# EasyEDA Pro project CoreBoard-001_2024-04-29.epro, board PCB-CoreBoard-001
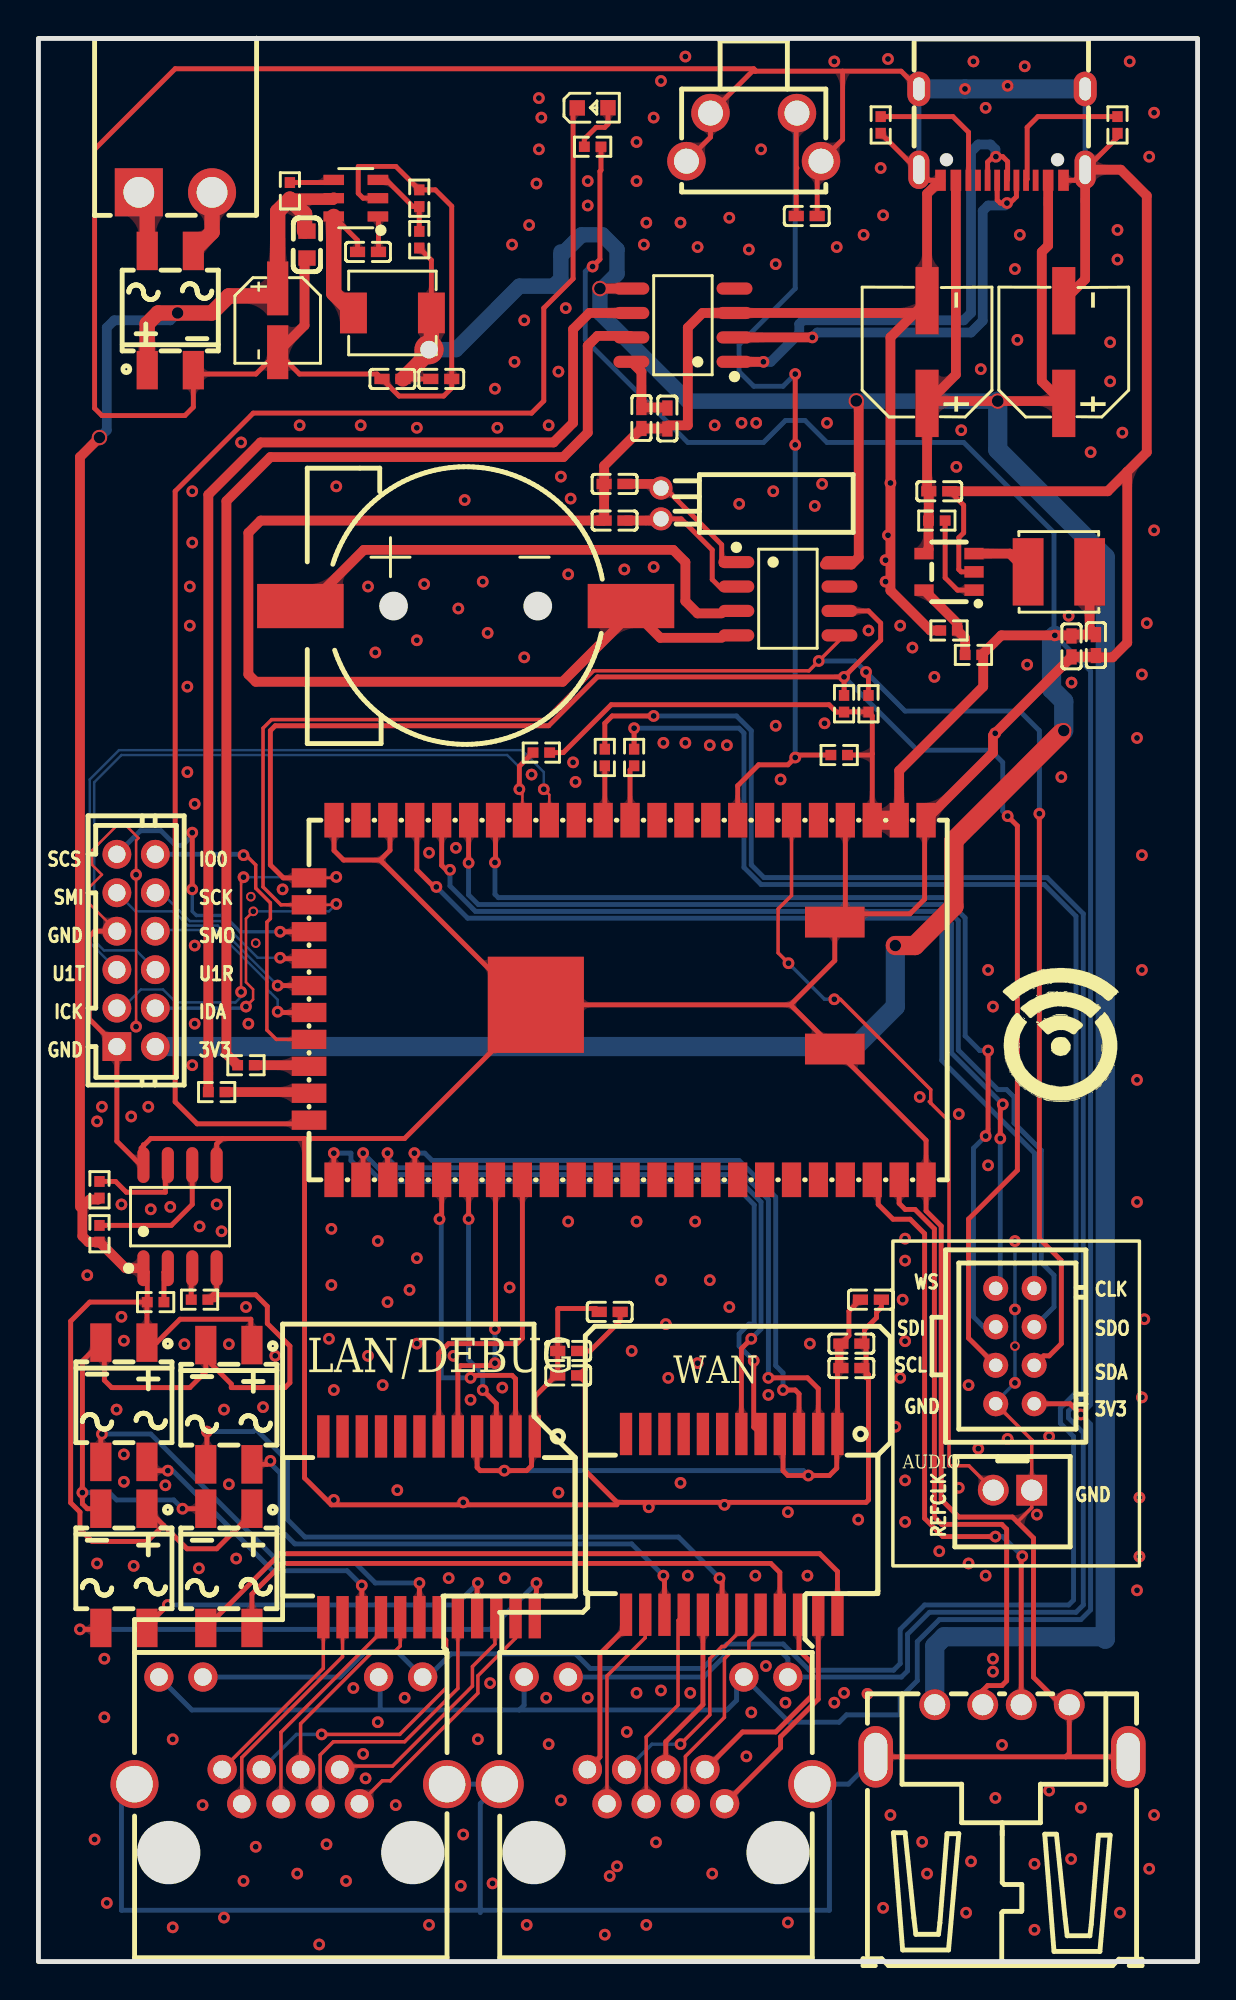
[diagram p6: board, top side]
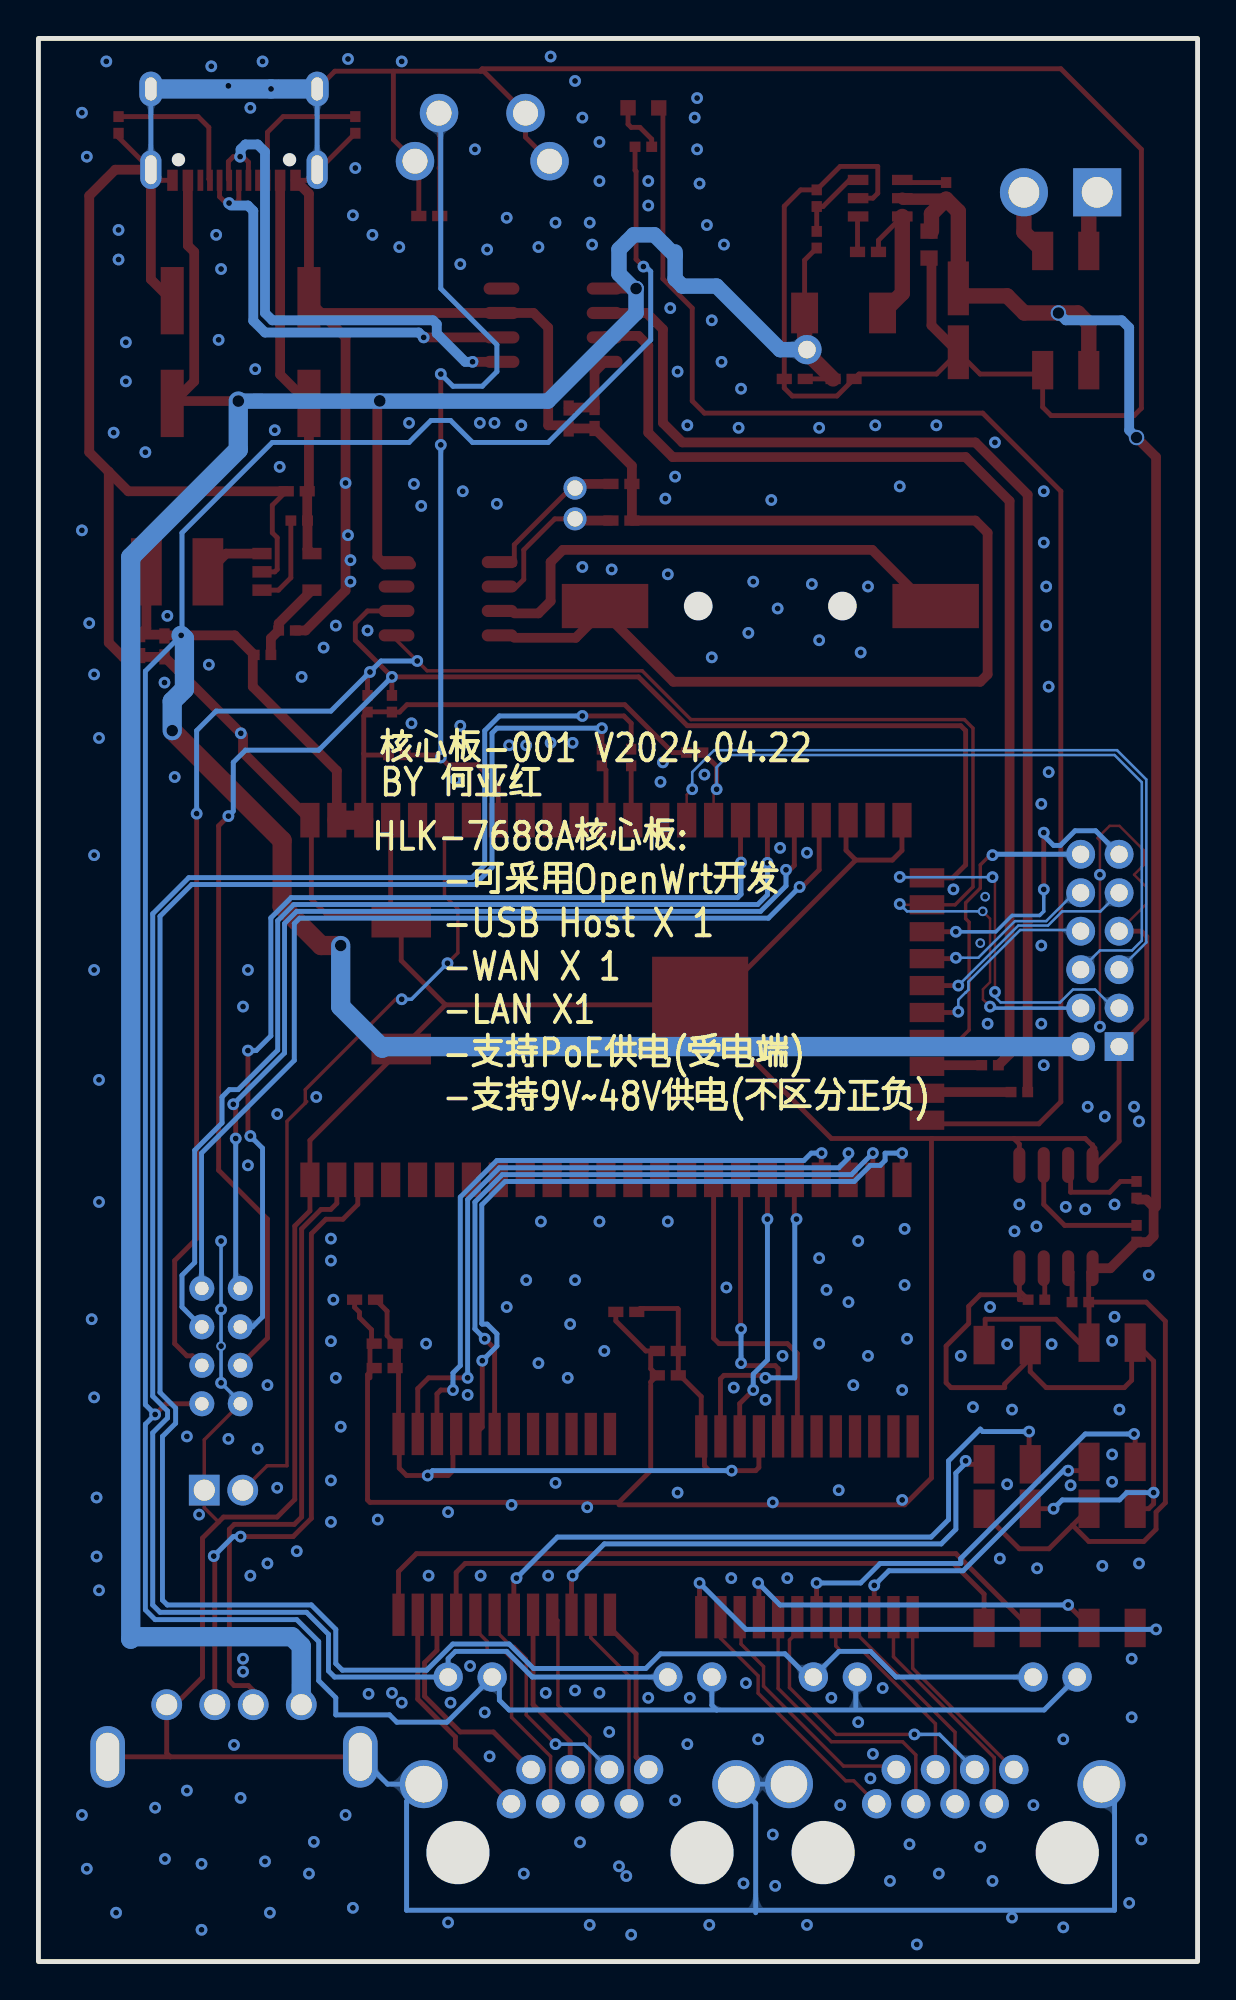
[diagram p7: board, bottom side, seen from below]

Outline 60.3 x 100 mm; copper layers: Top Layer, Bottom Layer. Coordinates in mm from the lower left corner of the outline.
Outline path: rectangle 0,100 60.3,0
Stack: Top Layer 0.035mm / Dielectric1 1.51mm FR4 er 4.5 / Bottom Layer 0.035mm

## Design rules (mm)
net USB_DP: USB
net USB_DM: USB
template: JLCPCB Capability(Two Layers Board)
spacing copperThickness1oz (default): track to track 0.102, other pairs 0.152 to 0.3
spacing copperThickness2oz: track to track 0.203, other pairs 0.152 to 0.3
track width copperThickness1oz (default): min 0.127, default 0.254, max 2.54
track width copperThickness2oz: min 0.203, default 0.254, max 2.54
differential pair differentialPair (default): width min 0.127, default 0.254, max 2.54; gap min 0.152, default 0.152
via viaSize (default): diameter min 0.5, default 0.61, max 10; hole min 0.3, default 0.305, max 6.3

## Placement (name value [footprint] x y rotation side)
BT1  CR1220-2ZX  [BAT-SMD_CR1220-2ZX]  22.23 70.48 0 top
C1  12pF  [C0402]  29.97 74.93 180 top
C2  12pF  [C0402]  29.97 76.83 180 top
C9  10uF  [C0402]  43.31 34.42 180 top
C15  10uF  [C0402]  46.86 76.45 180 top
C16  10uF  [C0402]  55.01 68.45 90 top
C17  100nF  [C0402]  53.74 68.39 90 top
C18  4.7uF  [CAP-SMD_BD4.0-L4.3-W4.3-FD-A]  12.45 85.34 270 top
C19  100nF  [C0603]  13.97 89.28 90 top
C20  10uF  [C0402]  18.42 82.3 180 top
C21  10uF  [C0402]  20.95 82.3 0 top
C22  100uF  [CAP-SMD_BD6.3-L6.6-W6.6-FD]  53.34 83.69 90 top
C23  100uF  [CAP-SMD_BD6.3-L6.6-W6.6-FD]  46.23 83.69 90 top
C24  100nF  [C0402]  31.37 80.26 90 top
C25  10uF  [C0402]  32.72 80.24 270 top
C26  100nF  [C0402]  39.97 90.77 180 top
C27  100nF  [C0402]  17.14 88.9 0 top
C28  10uF  [C0402]  42.29 30.86 180 top
C29  10uF  [C0402]  42.29 32.13 180 top
C30  10uF  [C0402]  27.56 30.48 180 top
C31  10uF  [C0402]  27.56 31.75 180 top
C32  10uF  [C0402]  29.72 33.78 180 top
CN1  DB2ERC-3.81-2P-GN  [CONN-TH_2P-P3.81_DB2ERC-3.81-2P]  7.13 92 180 top
CN2  扩展接口  [CONN-TH_12P-P2.00_HCTL_HC-PHD]  5.08 52.58 270 top
CN3  PH-2A  [CONN-TH_PH-2A_C2908623]  50.67 24.51 180 top
D1  MB10S  [MBS_L4.7-W3.8-P2.40-LS7.0-TL]  6.86 85.85 90 top
D2  MB10S  [MBS_L4.7-W3.8-P2.40-LS7.0-TL]  9.91 20.45 270 top
D3  MB10S  [MBS_L4.7-W3.8-P2.40-LS7.0-TL]  9.91 28.96 270 top
D4  MB10S  [MBS_L4.7-W3.8-P2.40-LS7.0-TL]  4.44 20.45 270 top
D5  MB10S  [MBS_L4.7-W3.8-P2.40-LS7.0-TL]  4.44 29.08 270 top
L1  4.7uH  [IND-SMD_L4.0-W4.0]  53.09 72.26 0 top
L2  10uH  [IND-SMD_L4.4-W4.2]  18.42 85.72 180 top
LED1  NCD0603R1  [LED0603-RD_RED]  28.83 96.39 0 top
NOREF  -  [Pad_e347]  20.32 83.82 0 top
R1  5.1kΩ  [R0402]  43.81 95.5 270 top
R2  5.1kΩ  [R0402]  56.13 95.5 270 top
R3  100Ω  [R0402]  9.27 45.21 180 top
R4  100Ω  [R0402]  10.8 46.61 180 top
R5  10kΩ  [R0402]  41.91 65.41 90 top
R6  10kΩ  [R0402]  43.18 65.41 90 top
R7  24.9kΩ  [R0402]  6.1 34.29 0 top
R8  33kΩ  [R0402]  3.17 40.13 270 top
R9  200kΩ  [R0402]  3.17 37.85 270 top
R11  1kΩ  [R0402]  46.74 74.93 180 top
R12  68kΩ  [R0402]  48.64 67.94 180 top
R13  15kΩ  [R0402]  47.37 69.22 180 top
R14  1kΩ  [R0402]  41.66 62.74 180 top
R15  1kΩ  [R0402]  28.83 94.37 0 top
R18  100kΩ  [R0402]  13.08 92.08 270 top
R19  10.7kΩ  [R0402]  19.81 91.69 270 top
R20  56kΩ  [R0402]  19.81 89.53 270 top
R21  1kΩ  [R0402]  29.46 62.61 270 top
R22  1kΩ  [R0402]  30.99 62.61 270 top
R23  10kΩ  [R0402]  26.16 62.86 180 top
RJ1  R-RJ45R08P-C000  [RJ45-TH_R-RJ45R08P-C000]  32.13 11.5 0 top
RJ2  R-RJ45R08P-C000  [RJ45-TH_R-RJ45R08P-C000]  13.13 11.5 0 top
SW1  TS665ZJ  [SW-TH_TS665ZJ]  37.21 94.87 180 top
U1  2.412GHz；2.483GHz  [WIRELM-SMD_HLK-7688A]  30.13 50 0 top
U2  DS1307M/TR  [SOP-8_L4.9-W3.9-P1.27-LS6.0-BL]  38.99 70.87 270 top
U3  SY8089AAAC  [SOT-23-5_L3.0-W1.7-P0.95-LS2.8-BR]  47.37 72.26 0 top
U4  CH340N  [SOP-8_L4.9-W3.9-P1.27-LS6.0-BL]  33.53 85.09 90 top
U5  LGS5148  [SOT-23-6_L2.9-W1.6-P0.95-LS2.8-BL]  16.51 91.69 90 top
U6  G2415S  [SMD-24_L15.1-W7.1-P1.00-LS10.0-BL]  36.07 22.73 180 top
U7  XS2100S  [SOP-8_L4.9-W3.9-P1.27-LS6.0-BL]  7.37 38.73 0 top
U8  G2415S  [SMD-24_L15.1-W7.1-P1.00-LS10.0-BL]  20.32 22.61 180 top
U9  1.27kΩ  [R0402]  8.38 34.42 180 top
U12  HC-PHB2.0-2x4A  [CONN-TH_8P-P2.00_HC-PHB2.0-2X4A]  50.8 32 270 top
USB1  TYPE-C 16PIN 2MD(073)  [USB-C-SMD_TYPE-C-6PIN-2MD-073]  50.13 95 180 top
USB2  U-USBAR04P-F002  [USB-A-TH_USB-302-T]  50.13 12 0 top
X1  32.768kHz  [OSC-TH_BD3.1-P0.8-D0.3]  32.39 75.82 180 top

## Footprints (pads in the part's own frame, mm; a bottom-side part is the same pattern mirrored in y, then rotated)
BAT-SMD_CR1220-2ZX
  rect 4.5x2.3 smd: 1(-8.6,0) 2(8.6,0)
C0402
  rect 0.79x0.54 smd: 1(-0.545,0) 2(0.545,0)
C0603
  rect 0.8x0.9 smd: 1(-0.7,0) 2(0.7,0)
CAP-SMD_BD4.0-L4.3-W4.3-FD-A
  rect 2.8x1.1 smd: 1(-1.661,0) 2(1.661,0)
CAP-SMD_BD6.3-L6.6-W6.6-FD
  rect 3.5x1.2 smd: 1(-2.67,0) 2(2.67,0)
CONN-TH_2P-P3.81_DB2ERC-3.81-2P
  rect 2.5x2.5 hole 1.6: 1(1.905,0)
  round 2.5 hole 1.6: 2(-1.905,0)
CONN-TH_8P-P2.00_HC-PHB2.0-2X4A
  round 1.3 hole 0.7: 1(3,-1) 2(3,1) 3(1,-1) 4(1,1) 5(-1,-1) 6(-1,1) 7(-3,-1) 8(-3,1)
CONN-TH_12P-P2.00_HCTL_HC-PHD
  rect 1.5x1.5 hole 0.9: 1(5,-1)
  round 1.5 hole 0.9: 2(5,1) 3(3,-1) 4(3,1) 5(1,-1) 6(1,1) 7(-1,-1) 8(-1,1) 9(-3,-1) 10(-3,1) 11(-5,-1) 12(-5,1)
CONN-TH_PH-2A_C2908623
  rect 1.6x1.6 hole 1.1: 1(-1,0)
  round 1.6 hole 1.1: 2(1,0)
IND-SMD_L4.0-W4.0
  rect 1.6x3.5 smd: 1(-1.6,0) 2(1.6,0)
IND-SMD_L4.4-W4.2
  rect 1.4x2.12 smd: 1(2.028,0) 2(-2.028,0)
LED0603-RD_RED
  rect 0.8x0.8 smd: 1(-0.799,-0.004) 2(0.799,0.004)
MBS_L4.7-W3.8-P2.40-LS7.0-TL
  rect 2x1.1 smd: 1(-3.1,1.2) 2(-3.1,-1.2) 3(3.1,-1.2) 4(3.1,1.2)
OSC-TH_BD3.1-P0.8-D0.3
  round 1.2 hole 0.8: 1(0,0.8) 2(0,-0.8)
Pad_e347
  round 1.524 hole 0.914: 60(0,0)
R0402
  rect 0.566x0.54 smd: 1(-0.433,0) 2(0.433,0)
RJ45-TH_R-RJ45R08P-C000
  round 1.524 hole 0.914: 1(3.57,-3.295) 2(2.55,-1.515) 3(1.53,-3.295) 4(0.51,-1.515) 5(-0.51,-3.295) 6(-1.53,-1.515) 7(-2.55,-3.295) 8(-3.57,-1.515) 9(-6.86,3.295) 10(-4.57,3.295) 11(4.57,3.295) 12(6.86,3.295)
  round 2.5 hole 1.9: 13(8.13,-2.275) 14(-8.13,-2.275)
SMD-24_L15.1-W7.1-P1.00-LS10.0-BL
  rect 0.64x2.2 smd: 1(-5.5,-4.7) 2(-4.5,-4.7) 3(-3.5,-4.7) 4(-2.5,-4.7) 5(-1.5,-4.7) 6(-0.5,-4.7) 7(0.5,-4.7) 8(1.5,-4.7) 9(2.5,-4.7) 10(3.5,-4.7) 11(4.5,-4.7) 12(5.5,-4.7) 13(5.5,4.7) 14(4.5,4.7) 15(3.5,4.7) 16(2.5,4.7) 17(1.5,4.7) 18(0.5,4.7) 19(-0.5,4.7) 20(-1.5,4.7) 21(-2.5,4.7) 22(-3.5,4.7) 23(-4.5,4.7) 24(-5.5,4.7)
SOP-8_L4.9-W3.9-P1.27-LS6.0-BL
  oval 0.63x1.865 smd: 1(-1.905,-2.683) 2(-0.635,-2.683) 3(0.635,-2.683) 4(1.905,-2.683) 5(1.905,2.683) 6(0.635,2.683) 7(-0.635,2.683) 8(-1.905,2.683)
SOT-23-5_L3.0-W1.7-P0.95-LS2.8-BR
  rect 1x0.6 smd: 1(1.3,-0.95) 2(1.3,0) 3(1.3,0.95) 4(-1.3,0.95) 5(-1.3,-0.95)
SOT-23-6_L2.9-W1.6-P0.95-LS2.8-BL
  rect 0.532x1.072 smd: 1(-0.95,-1.149) 2(0,-1.149) 3(0.95,-1.149) 4(0.95,1.149) 5(0,1.149) 6(-0.95,1.149)
SW-TH_TS665ZJ
  round 2 hole 1.3: 1(-2.25,-1.25) 2(2.25,-1.25) 3(-3.5,1.25) 4(3.5,1.25)
USB-A-TH_USB-302-T
  round 1.6 hole 1.1: 1(-3.5,1.355) 2(-1,1.355) 3(1,1.355) 4(3.5,1.355)
  oval 1.8x3.2 hole 1.2x2.5: 5(-6.57,-1.355) 6(6.57,-1.355)
USB-C-SMD_TYPE-C-6PIN-2MD-073
  rect 0.55x1.1 smd: 1(-3.2,2.375) 2(-2.4,2.375) 11(2.4,2.375) 12(3.2,2.375)
  rect 0.3x1.1 smd: 3(-1.75,2.375) 4(-1.25,2.375) 5(-0.75,2.375) 6(-0.25,2.375) 7(0.25,2.375) 8(0.75,2.375) 9(1.25,2.375) 10(1.75,2.375)
  oval 1.1x2 hole 0.6x1.5: 13(-4.325,1.825) 14(4.325,1.825)
  oval 1.2x1.8 hole 0.6x1.2: 13(-4.325,-2.375) 14(4.325,-2.375)
WIRELM-SMD_HLK-7688A
  rect 1x1.8 smd: 1(16.05,9.35) 2(14.65,9.35) 3(13.25,9.35) 4(11.85,9.35) 5(10.45,9.35) 6(9.05,9.35) 7(7.65,9.35) 8(6.25,9.35) 9(4.85,9.35) 10(3.45,9.35) 11(2.05,9.35) 12(0.65,9.35) 13(-0.75,9.35) 14(-2.15,9.35) 15(-3.55,9.35) 16(-4.95,9.35) 17(-6.35,9.35) 18(-7.75,9.35) 19(-9.15,9.35) 20(-10.55,9.35) 21(-11.95,9.35) 22(-13.35,9.35) 23(-14.75,9.35) 34(-14.75,-9.35) 35(-13.35,-9.35) 36(-11.95,-9.35) 37(-10.55,-9.35) 38(-9.15,-9.35) 39(-7.75,-9.35) 40(-6.35,-9.35) 41(-4.95,-9.35) 42(-3.55,-9.35) 43(-2.15,-9.35) 44(-0.75,-9.35) 45(0.65,-9.35) 46(2.05,-9.35) 47(3.45,-9.35) 48(4.85,-9.35) 49(6.25,-9.35) 50(7.65,-9.35) 51(9.05,-9.35) 52(10.45,-9.35) 53(11.85,-9.35) 54(13.25,-9.35) 55(14.65,-9.35) 56(16.05,-9.35)
  rect 1.8x1 smd: 24(-16.05,6.35) 25(-16.05,4.95) 26(-16.05,3.55) 27(-16.05,2.15) 28(-16.05,0.75) 29(-16.05,-0.65) 30(-16.05,-2.05) 31(-16.05,-3.45) 32(-16.05,-4.85) 33(-16.05,-6.25)
  rect 5x5 smd: 57(-4.25,-0.25)
  rect 3.1x1.6 smd: 58(11.3,-2.55) 59(11.3,4.05)

## Nets
As in the schematic, except:
5V: C15.2 C20.1 C21.1 C22.1 C23.1 L2.2 NOREF.60 R11.2 R20.2 U2.8 U3.4 U4.5 USB1.2 USB1.11 USB2.1

Pads without a net: U1 5 7 14 22; U2 7; U4 4; U6 7 8 9 10 11 12; U8 7 8 9 10 11 12; USB1 3 9

## Via types
v1: diameter 0.61, hole 0.305, Top Layer to Bottom Layer, 369 vias
v2: diameter 0.5, hole 0.305, Top Layer to Bottom Layer, 4 vias
v3: diameter 0.8, hole 0.6, Top Layer to Bottom Layer, 4 vias
v4: diameter 0.8, hole 0.61, Top Layer to Bottom Layer, 3 vias

## Routing (per net, layer and track width the routed paths; a pad name or vN(x,y) marks a point on that pad's centre or on a via; arc(x,y) is an arc through that point)
3V3: length 268.1
  Top Layer w0.254: 43.38,62.81 43.38,64.78 R6.1 43.17,64.99 41.91,64.99 ; 43.38,62.81 U1.3 ; 43.38,62.81 43.31,62.74 R14.1 ; v1(28.83,88.14) 29.21,88.52 29.21,93.09 29.26,93.14 R15.2 ; U12.2 53.67,29 v1(54.23,28.45) ; R5.1 41.51,64.97 41.13,65.35 29.79,65.35 27.3,62.86 R23.1
  Top Layer w0.508: 53.59,68.96 v1(52.88,68.96) 50.09,68.96 R12.1 49.15,67.87 49.15,66.29 44.78,61.92 U1.2 ; L1.2 54.69,69.33 C16.2 53.81,69 C17.2
  Top Layer w1: 53.21,63.88 47.62,58.29 47.62,54.86 45.59,52.83 v3(44.58,52.83) ; U1.3 U1.2
  Bottom Layer w0.254: RJ2.9 7.98,13.08 25.02,13.08 ; v1(52.88,68.96) 54.74,67.1 54.74,28.96 v1(54.23,28.45) 54.74,27.94 54.74,18.29 54.23,17.78 46.86,17.78 45.72,16.64 45.72,14.6 44.83,13.72 44.83,12.83 42.04,12.83 41.66,12.45 39.05,12.45 RJ1.11 36.32,14.42 36.32,13.59 35.81,13.08 25.02,13.08 ; RJ1.9 25.27,13.33 25.02,13.08 ; 17.78,13.21 17.78,14.71 RJ2.11 ; 52.83,68.96 52.83,74.3 48.13,78.99 41.02,78.99 39.88,80.14 38.86,80.14 37.72,78.99 33.78,78.99 28.45,84.33 28.45,87.88 28.7,88.14 v1(28.83,88.14)
  Bottom Layer w1: v3(44.58,52.83) 44.58,49.66 42.42,47.5 42.34,47.58 CN2.2 ; v1(52.88,68.96) 52.7,68.79 52.7,66.17 53.34,65.53 v3(53.34,64.01)
5V: length 178.8
  Top Layer w0.254: C21.1 C20.1 ; R20.2 20.44,88.47 L2.2
  Top Layer w0.508: 40.91,72.64 42.29,72.64 42.67,73.03 42.67,81.03 v4(42.55,81.15) ; 53.22,81.14 52.2,82.17 52.2,88.9 52.53,89.23 USB1.2 ; 53.22,81.14 v4(49.9,81.14) 46.35,81.14 ; 53.22,81.14 C22.1 ; v4(29.21,87) U4.5 ; USB1.11 47.73,82.52 46.35,81.14 ; 46.07,73.21 46.3,73.44 R11.2 46.32,74.94 C15.2 46.23,76.54 C23.1 46.35,81.14
  Top Layer w0.8: C20.1 20.44,83.78 L2.2
  Bottom Layer w0.8: v4(49.9,81.14) 33.79,81.14 29.21,85.72 v4(29.21,87) 29.34,87 30.1,87.76 30.1,89.03 29.34,89.79 28.26,89.79 27.18,88.71 ; 27.18,88.71 27.18,88.9 ; 27.18,88.71 27.18,87.5 26.8,87.12 25.02,87.12 21.72,83.82 NOREF.60
  Bottom Layer w1: v4(49.9,81.14) 49.9,78.62 55.5,73.03 55.5,16.76 55.37,16.89 47.12,16.89 46.63,16.4 USB2.1
GND: length 633.6
  Top Layer w0.13: v1(5.08,48.61) v1(5.08,56.52) 5.08,58.29 5.21,58.42 4.57,59.06 4.06,59.06 2.79,57.78 2.79,57.02 3.3,56.52 2.67,55.88 2.67,54.99 CN2.7
  Top Layer w0.18: U12.1 51.67,27.13 CN3.1 51.67,23.6 50.93,22.86
  Top Layer w0.254: R2.2 56.13,94.86 USB1.13 53.9,92.62 USB1.1 ; 17.78,57.28 18.29,57.78 18.29,59.24 U1.21 ; 17.78,57.28 25.31,49.75 U1.57 ; 17.78,57.28 15.87,57.28 15.38,57.78 U1.23 ; C15.1 48.13,75.73 48.13,74.3 47.88,74.04 47.88,72.39 48.01,72.26 U3.2 ; U1.1 46.1,59.27 46.1,55.25 45.34,54.48 42.04,54.48 ; 28.45,30.1 28.45,30.14 C30.1 28.45,30.82 28.45,31.75 ; 42.97,31.99 43.05,31.91 43.05,30.64 ; 42.97,31.99 42.97,32.85 43.6,33.48 43.6,33.77 43.85,34.02 C9.1 ; 42.97,31.99 C29.1 ; 53.44,10.65 USB2.6 ; 53.44,10.65 53.63,10.83 USB2.4 53.19,13.35 51.77,14.78 51.77,22.02 50.67,23.11 47.88,23.11 46.96,24.03 46.96,38.25 46.18,39.03 U1.56 46.18,42.7 U1.58 39.13,49.75 ; 53.44,10.65 USB2.5 ; 30.1,23.75 15.24,23.75 13.84,25.15 13.84,42.78 13.82,42.8 ; 5.46,42.42 5.46,42.48 ; 5.46,42.42 5.33,42.29 ; 5.46,42.42 5.84,42.8 9.56,42.8 ; 5.46,42.42 U7.8 5.39,41.35 4.08,42.66 CN2.1 2.64,49.02 2.64,53.3 2.92,53.58 CN2.7 ; U1.57 25.88,49.63 19.05,42.8 13.82,42.8 ; U1.57 39.13,49.75 ; C31.1 28.45,31.75 ; 28.45,31.75 28.7,31.75 30.26,33.31 C32.1 ; 39.13,49.75 41.43,52.05 U1.59 41.98,54.6 U1.4 ; 9.56,42.8 9.27,42.51 U7.5 ; 9.56,42.8 13.82,42.8 ; 43.05,30.64 43.18,30.52 43.18,24 43.05,23.88 30.1,23.88 28.45,25.53 28.45,29.97 ; 43.05,30.64 C28.1 ; 43.05,30.64 43.05,30.35 ; 37.3,98.3 37.3,98.34 37.21,98.42 7.11,98.42 2.92,94.23 2.92,80.77 3.3,80.39 7.62,80.39 8.06,80.83 8.06,82.55 ; 37.3,98.3 41.83,98.3 ; 37.3,98.3 37.14,98.3 SW1.2 34.96,94.87 SW1.4 ; 41.83,98.3 44.88,98.3 USB1.14 ; 41.83,98.3 41.83,94.74 SW1.3 40.51,93.42 C26.1 ; U5.2 16.89,91.69 16.64,91.95 16.64,93.34 18.59,93.34 R19.1 20.65,92.13 21.5,91.28 C21.2 21.5,81.83 21.08,81.41 18.76,81.41 C20.2 17.62,82.55 13.58,82.55 C18.2 11.31,82.55 8.06,82.55 ; 8.06,82.55 D1.2 ; USB1.12 46.35,92.62 USB1.14 45.71,93.17 R1.2
  Top Layer w0.508: 55.12,67.82 55.88,67.82 56.64,68.58 56.64,77.47 ; 35.54,68.83 32.35,68.83 30.95,70.23 27.27,66.55 11.3,66.55 10.92,66.93 10.92,74.3 11.56,74.93 C1.2 C2.2 29.43,77.78 C24.1 32.69,79.72 C25.2 ; 45.59,85.72 34.54,85.72 33.78,84.96 33.78,79.88 32.77,79.88 ; 45.59,85.72 C23.2 46.23,91.93 USB1.12 ; 45.59,85.72 44.32,84.46 v1(44.32,76.88) 44.32,71.29 46.4,69.22 R13.2 ; 56.64,77.47 57.66,78.49 57.66,91.82 56.3,93.17 USB1.13 54.45,87.47 C22.2 ; 56.64,77.47 55.63,76.45 C15.1 ; 13.84,88.58 13.84,85.08 C18.2 ; U1.1 46.18,59.39 49.66,62.86 49.66,63.76 C17.1 54.94,67.84 C16.1
  Bottom Layer w0.18: v1(50.8,37.47) v1(50.8,33.91) v2(50.8,32) v1(50.8,30.09) 49.8,29.09 U12.1
  Bottom Layer w0.254: 22.99,2.54 22.99,2.67 ; 22.99,2.67 41.15,2.67 41.15,8.33 RJ1.13 42.14,9.22 USB2.5 ; 22.99,2.67 4.32,2.67 4.32,8.55 RJ2.14 ; 22.99,2.67 22.99,8.22 RJ1.14 RJ2.13 ; USB1.13 USB1.13 ; USB1.14 USB1.14
  Bottom Layer w1: USB1.14 v1(48.2,97.38) USB1.13
  vias: v1(2.54,35.69) v1(2.92,6.35) v1(3.05,43.69) v1(3.05,20.7) v1(3.3,44.45) v1(3.43,15.75) v1(3.43,12.7) v1(3.56,3.05) v1(4.06,28.7) v1(4.32,39.37) v1(4.32,33.53) v1(4.44,32.28) v1(4.44,26.37) v1(4.44,24.95) v1(4.83,43.94) v1(4.95,20.57) v1(5.71,44.45) v1(5.84,39.12) v1(6.6,24.76) v1(6.86,39.24) v1(6.98,11.56) v1(6.98,1.78) v1(7.59,32.1) v1(7.75,66.29) v1(7.75,61.85) v1(7.87,71.5) v1(7.87,69.47) v1(8,76.45) v1(8,73.79) v1(8,46.61) v1(8.13,60.2) v1(8.13,52.83) v1(8.13,48.77) v1(8.35,20.45) v1(8.38,38.23) v1(8.54,8.13) v1(9.27,39.37) v1(9.52,37.97) v1(9.65,28.7) v1(9.65,2.29) v1(9.91,32.1) v1(9.91,24.82) v1(10.29,20.96) v1(10.54,78.99) v1(10.67,4.19) v1(10.8,34.04) v1(10.92,48.77) v1(11.3,5.97) v1(11.68,28.83) v1(12.32,31.5) v1(12.7,55.75) v1(13.46,4.57) v1(13.59,79.88) v1(14.61,0.89) v1(14.99,6.1) v1(15.11,32.39) v1(15.24,38.1) v1(15.24,35.18) v1(15.37,29.72) v1(15.37,24) v1(15.49,76.71) v1(16,4.19) v1(16.38,14.22) v1(16.76,79.88) v1(16.89,10.79) v1(17.02,9.53) v1(17.14,71.5) v1(17.14,31.5) v1(17.53,68.07) v1(17.65,37.47) v1(17.65,12.45) v1(17.91,29.97) v1(18.16,34.29) v1(18.67,24.51) v1(18.59,8.13) v1(19.05,13.72) v1(19.3,34.92) v1(19.68,79.76) v1(19.68,68.71) v1(19.68,36.58) v1(19.68,32.13) v1(20.07,71.63) v1(20.32,57.66) v1(20.32,1.91) v1(21.34,19.94) v1(21.59,31.5) v1(21.72,57.91) v1(21.84,70.36) v1(21.97,3.94) v1(22.17,76) v1(22.1,23.88) v1(22.1,6.6) v1(22.48,29.21) v1(22.86,11.56) v1(23.11,71.75) v1(23.37,69.09) v1(23.49,14.48) v1(23.62,4.06) v1(23.75,81.79) v1(23.88,79.76) v1(24.13,29.84) v1(24.26,19.94) v1(24.51,35.05) v1(24.64,89.28) v1(24.77,83.19) v1(25.27,85.34) v1(25.27,67.82) v1(25.4,1.91) v1(25.53,90.3) v1(25.65,61.72) v1(25.91,92.46) v1(26.03,96.9) v1(26.03,94.23) v1(26.16,95.89) v1(26.42,13.72) v1(26.54,79.88) v1(26.54,11.3) v1(27.05,82.68) v1(27.05,24.38) v1(27.18,77.22) v1(27.18,8.38) v1(27.43,85.98) v1(27.56,72.14) v1(27.56,38.48) v1(27.69,76.07) v1(27.81,62.36) v1(27.94,61.34) v1(28.58,92.58) v1(28.58,91.31) v1(28.58,13.72) v1(29.46,1.4) v1(29.72,4.44) v1(30.1,4.95) v1(30.48,72.39) v1(30.61,11.94) v1(30.86,31.75) v1(31.11,94.61) v1(31.11,92.58) v1(31.11,38.48) v1(31.11,13.97) v1(31.5,89.28) v1(31.62,90.42) v1(31.62,1.91) v1(31.75,23.62) v1(32,95.89) v1(32,72.52) v1(32.13,6.2) v1(32.39,97.79) v1(32.39,35.43) v1(32.39,14.1) v1(32.51,63.37) v1(32.64,33.15) v1(32.77,30.35) v1(33.4,90.42) v1(33.4,24.89) v1(33.65,99.06) v1(33.65,63.37) v1(33.78,20.07) v1(33.91,13.97) v1(34.16,38.48) v1(34.29,89.15) v1(34.29,31.12) v1(34.92,63.25) v1(34.92,35.43) v1(35.05,4.57) v1(35.18,79.88) v1(35.69,23.75) v1(35.81,63.25) v1(35.94,90.68) v1(35.94,34.04) v1(36.45,75.8) v1(36.58,80.01) v1(36.83,10.67) v1(36.96,89.03) v1(37.08,12.95) v1(37.34,80.01) v1(37.3,20.07) v1(37.59,94.23) v1(37.85,15.37) v1(37.97,29.46) v1(38.23,76.45) v1(38.35,88.27) v1(38.35,64.26) v1(38.61,61.47) v1(38.86,13.46) v1(38.99,23.37) v1(38.99,2.03) v1(40,20.07) v1(40.13,32.13) v1(40.39,75.69) v1(40.77,76.83) v1(40.89,64.39) v1(41.02,80.01) v1(41.4,98.81) v1(41.4,13.46) v1(41.53,89.15) v1(41.91,13.97) v1(42.65,22.98) v1(42.93,89.79) v1(43.13,13.92) v1(43.18,69.22) v1(43.81,93.26) v1(43.94,90.81) v1(43.94,2.79) v1(44.07,72.87) v1(44.07,71.75) v1(44.2,98.93) v1(44.2,74.17) v1(44.32,7.62) v1(44.58,27.81) v1(44.83,69.47) v1(44.83,30.35) v1(44.96,34.42) v1(45.08,37.59) v1(45.08,36.45) v1(45.08,32.26) v1(45.08,25.02) v1(45.08,22.86) v1(45.47,68.33) v1(45.85,44.96) v1(45.97,6.22) v1(46.23,4.57) v1(46.61,66.8) v1(46.86,21.34) v1(47.75,77.72) v1(47.88,44.07) v1(47.88,24.64) v1(48.01,79.63) v1(48.26,2.54) v1(48.39,29.97) v1(48.39,20.7) v1(48.51,5.21) v1(48.64,98.81) v1(48.89,26.67) v1(49.02,82.8) v1(49.28,96.39) v1(49.28,20.07) v1(49.4,51.56) v1(49.4,41.4) v1(49.66,49.66) v1(49.66,15.75) v1(49.66,15.07) v1(49.77,63.87) v1(49.78,8.51) v1(50.13,11.26) v1(50.42,97.54) v1(50.42,27.18) v1(50.8,88.01) v1(50.93,84.33) v1(51.05,89.79) v1(51.31,98.55) v1(51.43,67.44) v1(51.82,5.08) v1(51.82,1.65) v1(51.94,23.24) v1(52.58,27.31) v1(52.58,8.89) v1(53.21,61.59) v1(53.59,69.98) v1(53.74,66.51) v1(53.72,5.33) v1(54.23,8) v1(54.74,78.49) v1(55.75,84.2) v1(55.75,82.17) v1(56.13,90.04) v1(56.13,88.5) v1(56.26,2.54) v1(56.39,79.5) v1(56.77,98.81) v1(57.15,63.63) v1(57.15,45.85) v1(57.15,39.5) v1(57.15,19.3) v1(57.28,24.13) v1(57.28,21.06) v1(57.4,66.93) v1(57.4,57.53) v1(57.4,51.56) v1(57.4,29.34) v1(57.53,33.4) v1(57.66,69.6) v1(57.78,93.85) v1(57.78,4.83) v1(58.04,96.14) v1(58.04,74.42) v1(58.04,7.62) v2(11.05,55.37) v2(11.3,52.96)
GND_POE: length 40.9
  Top Layer w0.254: 8.71,31.36 10.03,30.03 10.03,29.84 12.83,29.84 13.08,30.1 13.08,32 11.91,33.18 11.91,34.07 11.3,34.67 9.27,34.67 9.27,34.42 U9.1 9.27,34.87 U7.4 ; 8.71,31.36 D3.2 ; 8.71,31.36 8.71,30.68 7.87,29.84 3.81,29.84 3.43,30.23 3.43,32 D5.2 2.29,31.22 v1(2.29,24.38) 2.29,23.8 2.54,23.55 D4.2 ; D2.2 v1(7.49,23.55)
  Bottom Layer w0.254: v1(2.29,24.38) 3.68,24.38 4.06,24 7.04,24 v1(7.49,23.55)
VIN: length 114.9
  Top Layer w0.254: 6.5,22.69 5.66,21.84 2.79,21.84 2.16,22.48 2.16,23.37 1.68,23.86 1.68,33.3 2.67,34.29 R7.1 ; 6.5,22.69 7.73,21.46 9.27,21.46 11.11,23.3 11.11,23.55 ; 6.5,22.69 D4.1 ; U7.1 5.66,35.85 R7.1 ; R7.1 5.64,34.27 D5.1 6.15,32.18 7.37,33.4 11.05,33.4 11.05,32.11 11.11,32.06
  Top Layer w0.508: R8.2 3.1,39.62 2.67,39.62 2.29,39.24 2.29,37.72 2.59,37.41 R9.2 4.54,36.05 U7.1 ; 3.05,79.12 2.16,78.23 2.16,39.24
  Top Layer w0.6: U5.5 15.31,91.64 R18.2
  Top Layer w0.8: 12.45,86.74 C18.1 ; C18.1 12.45,91.01 R18.2 13.84,90.88 13.84,89.98 ; C18.1 12.06,86.61 9.91,86.61 9.02,85.72 v3(7.24,85.72) 6.22,85.72 5.66,85.16 5.66,82.75
  Bottom Layer w0.508: v3(3.17,79.25) 3.56,79.63 3.56,84.96 3.94,85.34 6.86,85.34 v3(7.24,85.72)
CONSOLE-RX: length 4.4
  Top Layer w0.508: R3.1 14.02,45.21 U1.32
CONSOLE-TX: length 2.9
  Top Layer w0.508: U1.31 14.02,46.61 R4.1
DEBUG-RX: length 56.9
  Top Layer w0.508: R4.2 9.78,47.19 9.78,75.95 12.06,78.23 27.3,78.23 28.58,79.5 28.58,84.02 29.08,84.53 30.77,84.53 U4.7
DEBUG-TX: length 59.8
  Top Layer w0.508: R3.2 8.84,76.28 11.56,78.99 26.8,78.99 27.81,80.01 27.81,84.88 28.66,85.72 30.85,85.72
DM-UP: length 23.4
  Top Layer w0.254: USB1.7 49.88,91.6 50.04,91.44 50.55,91.44 50.88,91.77 USB1.5
  Top Layer w0.508: v1(40.26,84.45) U4.2
  Bottom Layer w0.508: v1(40.26,84.45) 40.51,84.71 48.51,84.71 49.12,85.32 49.12,91.03 49.4,91.31 50.29,91.31
  vias: v1(50.38,91.44)
DP-UP: length 26.9
  Top Layer w0.254: USB1.6 50.42,92.67 50.42,93.6 50.17,93.85 49.66,93.85 49.38,93.57 USB1.8
  Top Layer w0.508: U4.1 37.59,83.19
  Bottom Layer w0.508: 49.78,93.98 49.78,94.23 49.53,94.49 48.89,94.49 48.51,94.11 48.51,85.72 48.13,85.34 39.77,85.34 39.58,85.15 39.58,84.66 38.1,83.19 v1(37.72,83.19)
  vias: v1(49.81,93.85)
ETH-LED0: length 2.9
  Top Layer w0.254: R21.2 29.46,59.44 U1.13
ETH-LED1: length 2.9
  Top Layer w0.254: U1.12 30.78,61.97 R22.2
ETH-RN0: length 35.7
  Top Layer w0.254: v1(16.89,42.04) 16.89,40.76 U1.35 ; v1(37.08,32.39) 36.57,31.87 U6.6
  Bottom Layer w0.254: v1(16.89,42.04) 18.01,40.92 36.17,40.92 37.59,39.5 37.59,32.89 v1(37.08,32.39)
ETH-RN1: length 17.2
  Top Layer w0.254: U1.41 25.18,32.42 24.89,32.13 21.34,32.13 20.82,31.62 U8.6
ETH-RP0: length 37.3
  Top Layer w0.254: U1.34 15.37,40.66 v1(15.37,42.04) ; 37.21,31.12 37.21,27.79 U6.5
  Bottom Layer w0.254: v1(37.21,31.24) 36.45,32 36.45,32.64 36.96,33.15 37.21,33.15 37.24,33.17 37.24,39.35 36.02,40.56 17.86,40.56 17.02,41.4 16.51,41.4 16.26,41.66 16.26,42.04 v1(15.37,42.04)
ETH-RP1: length 15.1
  Top Layer w0.254: U8.5 21.82,30.84 21.97,30.99 23.62,30.99 v1(23.75,31.12) ; v1(23.75,32.89) 23.78,32.92 U1.40
  Bottom Layer w0.254: v1(23.75,31.12) v1(23.75,32.89)
ETH-TN0: length 34.3
  Top Layer w0.254: v1(19.56,42.04) 19.58,42.02 U1.37 ; U6.3 39.57,29.52 39.37,29.72 v1(38.73,29.72)
  Bottom Layer w0.254: v1(19.56,42.04) 20.09,42.04 20.48,41.66 36.45,41.66 38.35,39.75 38.35,30.99 38.73,30.61 v1(38.73,29.72)
ETH-TN1: length 13.9
  Top Layer w0.254: v1(23.11,29.72) 23.82,29.01 U8.3 ; U1.39 v1(22.38,38.61)
  Bottom Layer w0.254: v1(22.38,38.61) 22.38,31.28 23.11,30.54 v1(23.11,29.72)
ETH-TP0: length 36.8
  Top Layer w0.254: v1(37.97,30.35) 40,30.35 40.57,29.79 U6.2 ; v1(18.16,42.04) 18.16,40.67 U1.36
  Bottom Layer w0.254: v1(18.16,42.04) 18.16,41.78 18.67,41.28 36.32,41.28 37.97,39.62 v1(37.97,30.35)
ETH-TP1: length 17.2
  Top Layer w0.254: U1.38 20.98,38.61 ; U8.2 24.82,30.3 24.64,30.48 22.73,30.48 22.61,30.35
  Bottom Layer w0.254: v1(22.48,30.35) 20.95,30.35 20.95,38.52 v1(20.86,38.61)
GPIO0: length 16.8
  Top Layer w0.18: v1(10.67,57.53) 10.8,57.53 11.3,57.02 11.3,55.81 12.06,55.05 12.06,54.23 11.89,54.05 11.89,48.44 12.37,47.95 U1.30
  Bottom Layer w0.254: v1(10.67,57.53) 10.62,57.58 CN2.12
I2C-SCK: length 110.3
  Top Layer w0.13: U1.24 15.44,56.35 v1(15.49,56.4) ; v1(10.67,56.39) 10.54,56.26 v1(10.54,50.42)
  Top Layer w0.254: U12.3 48.39,32.42 48.39,38.61 50.93,41.15 50.93,59.06 v1(50.42,59.56) ; 41.78,66.8 29.08,66.8 26.54,64.26 12.32,64.26 12.06,64.01 12.06,57.02 12.74,56.35 U1.24 ; 41.78,66.8 v1(41.91,66.8) 43.81,68.71 43.81,69.6 43.18,70.23 41.93,70.23 ; 41.78,66.8 41.91,66.67 41.91,65.85
  Bottom Layer w0.13: CN2.3 4.37,49.58 5.33,50.55 6.48,50.55 7.15,49.87 10.25,49.87 10.54,50.17 v1(10.54,50.42) ; v1(10.67,56.39) 15.37,56.39 15.49,56.52
  Bottom Layer w0.254: v1(41.91,66.8) 45.72,62.99 49.53,62.99 50.17,62.36 50.17,59.82 v1(50.42,59.56)
I2C-SDA: length 107.8
  Top Layer w0.13: U1.25 15.45,54.95 v1(15.49,54.99) ; v1(10.8,49.66) 11.17,50.03 11.17,50.56 10.8,50.93 10.8,54.23 v2(11.18,54.61)
  Top Layer w0.18: U1.25 12.61,54.95 11.68,55.88 11.68,64.14 12.13,64.58 26.35,64.58 28.89,67.12 40.08,67.12 v1(40.59,67.63) 41.93,68.96
  Top Layer w0.254: v1(43.05,67.06) 43.18,66.93 R6.2 ; U12.4 52.29,31.5 52.58,31.5 53.21,32.13 53.21,36.45 52.07,37.59 v1(52.07,59.69)
  Bottom Layer w0.13: v2(11.18,54.61) 15.11,54.61 v1(15.49,54.99)
  Bottom Layer w0.18: CN2.4 10.72,49.58 v1(10.8,49.66)
  Bottom Layer w0.254: v1(40.59,67.63) 42.48,67.63 v1(43.05,67.06) 45.08,65.02 51.05,65.02 52.07,64.01 v1(52.07,59.69)
I2S-CLK: length 52.1
  Top Layer w0.254: U1.20 19.68,59.24 19.68,56.77 20.57,55.88 v1(20.7,55.88)
  Bottom Layer w0.254: U12.8 51.82,35.02 51.82,42.04 46.99,46.86 46.99,53.97 46.71,54.25 22.33,54.25 v1(20.7,55.88)
I2S-SDI: length 51.9
  Top Layer w0.254: v1(49.28,42.93) 49.4,43.05 v1(49.4,47.37) ; U1.17 23.78,57.28
  Bottom Layer w0.254: U12.5 49.17,33 48.64,33.53 48.64,42.29 v1(49.28,42.93) ; v1(49.4,47.37) 48.97,47.37 48.21,48.13 48.21,54.27 47.16,55.32 23.93,55.32 23.75,55.5 v1(23.75,57.15)
I2S-SDO: length 53.9
  Top Layer w0.254: U1.18 22.38,57.02
  Bottom Layer w0.254: U12.6 52.83,34.04 52.83,35.69 52.17,36.35 52.17,42.18 50.75,43.61 50.75,44.96 50.37,45.34 49.91,45.34 47.85,47.4 47.85,54.12 47.01,54.97 22.88,54.97 22.38,55.47 v1(22.38,57.13)
I2S-WS: length 50.6
  Top Layer w0.254: v1(50.17,44.58) 50.04,44.45 v1(50.04,42.8) ; 21.21,56.77 20.98,57 U1.19
  Bottom Layer w0.254: v1(50.04,42.8) 50.04,35.24 U12.7 ; v1(50.17,44.58) 47.5,47.24 47.5,53.97 46.86,54.61 22.73,54.61 21.41,55.93 v1(21.41,56.77)
KEY-RESTART: length 50.7
  Top Layer w0.254: U1.8 36.38,61.14 37.46,62.23 38.99,62.23 v1(39.37,62.61) 39.5,62.74 R14.2 ; v1(39.37,78.87) v1(39.37,82.55) ; 39.42,93.26 39.42,96.08 SW1.1 ; 39.42,93.26 39.46,93.26 ; 39.42,93.26 C26.2
  Bottom Layer w0.254: v1(39.37,82.55) 38.73,81.92 37.21,81.92 36.45,82.68 36.45,84.07 39.37,87 39.37,96.03 SW1.1 ; 39.37,78.74 v1(39.37,62.61)
PHY0_LED: length 102.5
  Top Layer w0.254: v1(32,64.77) 29.84,64.77 29.46,64.39 R21.1
  Bottom Layer w0.254: v1(32,64.77) 36.32,64.77 37.08,64 37.08,57.02 37.74,56.36 52.48,56.36 54.36,54.48 54.36,29.4 53.58,28.63 53.58,28.27 54.36,27.49 54.36,18.54 53.98,18.16 46.36,18.16 45.21,17.02 45.21,15.11 44.89,14.79 RJ1.12 38.99,15.75 38.61,16.13 35.94,16.13 34.61,14.79 RJ1.10
PHY0_MDI0: length 37.1
  Top Layer w0.254: D2.3 12.57,21.21 40.64,21.21 41.57,20.28 41.57,18.03
PHY0_MDI1: length 32.3
  Top Layer w0.254: 38.57,18.03 38.57,20.23 38.1,20.7 12.7,20.7 11.11,19.11 11.11,17.35
PHY0_MDI2: length 35.4
  Top Layer w0.254: D3.3 8.76,25.91 v1(8.76,27.56) ; 35.57,18.03 35.57,19.8 v1(35.43,19.94)
  Bottom Layer w0.254: v1(8.76,27.56) 11.18,27.56 11.3,27.69 12.95,26.03 12.95,22.98 13.86,22.07 33.3,22.07 v1(35.43,19.94)
PHY0_MDI3: length 27.6
  Top Layer w0.254: 11.11,25.86 11.89,25.86 v1(12.06,26.03) ; 32.57,18.03 32.57,19.94
  Bottom Layer w0.254: v1(32.51,20.07) 30.86,21.72 13.33,21.72 12.57,22.48 12.57,25.4 12.06,25.91 v1(12.06,26.03)
PHY1_LED: length 119.3
  Top Layer w0.254: R22.1 v1(30.99,64.14)
  Bottom Layer w0.254: RJ2.10 15.68,14.79 17.02,16.13 18.65,16.13 RJ2.12 20.26,14.79 21.46,16 27.94,16 28.7,15.24 34.54,15.24 35.81,16.51 38.74,16.51 40.1,15.15 44.49,15.15 44.83,15.49 44.83,17.27 46.1,18.54 53.59,18.54 53.85,18.8 53.85,27.31 53.16,27.99 53.16,28.78 53.98,29.59 53.98,54.36 52.32,56.01 37.59,56.01 36.7,56.9 36.7,63.88 36.45,64.14 v1(30.99,64.14)
PHY1_MDI0: length 27.7
  Top Layer w0.254: D4.3 3.17,17.27 v1(2.16,17.27) ; U8.24 25.91,17.99 v1(25.91,19.69)
  Bottom Layer w0.254: v1(2.16,17.27) 23.49,17.27 v1(25.91,19.69)
PHY1_MDI1: length 19.9
  Top Layer w0.254: v1(6.73,18.54) 5.64,17.46 D4.4 ; U8.21 22.82,19.56
  Bottom Layer w0.254: v1(6.73,18.54) 21.72,18.54 v1(22.86,19.69)
PHY1_MDI2: length 23.1
  Top Layer w0.254: U8.18 v1(19.82,19.69) ; v1(3.3,27.43) 3.24,27.38 D5.3
  Bottom Layer w0.254: v1(19.82,19.69) 17.53,19.69 16.51,20.7 12.32,20.7 12.32,20.96 5.84,27.43 v1(3.3,27.43)
PHY1_MDI3: length 15.6
  Top Layer w0.254: U8.15 v1(16.82,19.56) ; D5.4 6.1,25.53 v1(6.73,25.53)
  Bottom Layer w0.254: v1(6.73,25.53) 6.86,25.65 12.19,20.32 16.06,20.32 v1(16.82,19.56)
REFCLK: length 41.1
  Top Layer w0.18: U1.6 39.18,55.43 38.48,54.74 38.48,52.45 39.12,51.82 ; CN3.2 48.4,25.78 47.37,25.78 47.37,43.69 46.42,44.64 ; 46.42,44.64 46.42,45.34 41.72,50.04 v1(41.4,50.04) ; 46.42,44.64 46.34,44.72
  Bottom Layer w0.18: v1(39.02,51.91) 40.89,50.04 v1(41.4,50.04)
SPI-CLK: length 9.3
  Top Layer w0.254: U1.27 12.75,52.15 12.7,52.2
  Bottom Layer w0.13: v1(12.57,52.2) 11.4,52.2 9.5,54.1 7.87,54.1 6.4,55.58 CN2.10
SPI-CS1: length 15.8
  Top Layer w0.254: v1(8,55.75) v1(8,58.7) ; U1.26 v1(12.57,53.55)
  Bottom Layer w0.18: v1(12.57,53.55) 12.57,53.55 10.49,53.55 9.65,54.4 8.21,54.4 8,54.61 v1(8,55.75)
  Bottom Layer w0.254: 8,58.8 8,58.55 7.49,58.04 7.13,58.04 6.37,58.8 5.3,58.8 CN2.11
SPI-MISO: length 12
  Top Layer w0.254: U1.28 v1(12.45,50.75)
  Bottom Layer w0.13: CN2.9 5.05,54.61 7.04,54.61 7.78,53.87 9.33,53.87 v1(12.45,50.75)
SPI-MOSI: length 10.3
  Top Layer w0.254: U1.29 12.57,49.35
  Bottom Layer w0.13: CN2.8 6.14,53.64 9.23,53.64 11.92,50.95 11.92,50.53 12.05,50.4 12.06,50.4 12.45,50.01 v1(12.45,49.39)
SYS-LED: length 76.3
  Top Layer w0.254: U1.33 13.89,43.56 8.25,43.56 7.11,44.7 7.11,76.45 11.18,80.52 25.65,80.52 26.29,81.15 26.29,85.98 27.81,87.5 27.81,96.17 LED1.1
UART1-RX: length 40.1
  Top Layer w0.13: v1(25.02,60.96) 25.18,60.8 U1.16
  Top Layer w0.254: v1(25.02,60.96) 25.02,62.16 R23.2
  Bottom Layer w0.13: 24.89,60.96 25.02,61.09 25.02,62.1 24.38,62.74 4.32,62.74 2.9,61.32 2.9,53.09 3.41,52.58 5.08,52.58 CN2.6
UART1-TX: length 38
  Top Layer w0.13: U1.15 26.58,60.67 v1(26.29,60.96)
  Bottom Layer w0.13: 26.42,60.83 v1(26.29,60.96) 26.29,61.85 25.15,62.99 4.19,62.99 2.67,61.47 2.67,52.99 CN2.5
USB_DM: length 32.7
  Top Layer w0.254: USB2.2 49.13,14.1 49.38,14.35 50.12,14.35 50.37,14.6 50.37,22.48 50.11,22.73 46.99,22.73 46.61,23.11 46.61,38.1 45.6,39.11 45.09,39.11 44.78,39.42 U1.55
USB_DP: length 32.9
  Top Layer w0.254: U1.54 43.69,40.34 43.69,39.37 44.46,38.6 45.35,38.6 46.1,37.85 46.1,23.05 47.05,22.1 v1(49.78,22.1) ; v1(51.18,21.08) 51.13,21.03 USB2.3
  Bottom Layer w0.254: v1(51.18,21.08) 50.17,22.1 v1(49.78,22.1)
$1N1673: length 2.8
  Top Layer w0.254: R15.1 28.4,94.77 29.01,95.38 29.46,95.38 29.63,95.54 LED1.2
$2N388: length 3.2
  Top Layer w0.508: 48.67,73.21 50.54,73.21 L1.1
$2N391: length 4.7
  Top Layer w0.254: U3.1 47.81,71.31 47.17,71.96 R11.1
$2N396: length 4.3
  Top Layer w0.508: U3.5 47.8,69.58 R13.1 48.21,68.81 48.21,67.94
$2N582: length 7.4
  Top Layer w0.254: USB1.10 48.39,92.64 48.39,95.12 47.57,95.94 43.81,95.94
$2N583: length 7.7
  Top Layer w0.254: 56.13,95.94 51.99,95.94 51.43,95.38 51.43,92.68 USB1.4
$2N928: length 4
  Top Layer w0.508: 32.72,80.78 32.69,80.81 C24.2 31.37,82.66 U4.8
$2N1878: length 1.9
  Top Layer w0.254: U5.1 17.69,90.71 C27.2
$2N1881: length 2.3
  Top Layer w0.254: U5.4 15.23,92.51 R18.1
$2N1882: length 7.8
  Top Layer w0.254: U5.6 16.6,89.5 C27.1
  Top Layer w0.8: L2.1 15.36,86.75 U5.6
$2N1886: length 4
  Top Layer w0.254: U5.3 18.1,92.64 19.48,91.26 R19.2 R20.1
$2N2880: length 3.5
  Top Layer w0.8: CN1.2 9.03,89.93 D1.3
$2N2893: length 3.2
  Top Layer w0.8: CN1.1 5.66,91.56 5.66,88.95
$3N214: length 25.7
  Top Layer w0.508: 13.75,70.23 16.93,73.41 33.02,73.41 33.65,72.77 33.65,70.74 34.29,70.1 35.54,70.1
$3N217: length 8.2
  Top Layer w0.254: X1.2 32.6,76.62 35.54,73.68 35.54,72.64 36.18,72.64 U2.1
  Top Layer w0.508: X1.2 32.17,76.83 C2.1
$3N218: length 7.5
  Top Layer w0.254: 35.54,71.37 35.05,71.87 35.05,73.41 33.44,75.02 X1.1
  Top Layer w0.508: X1.1 32.3,74.93 C1.1
$5N391: length 11.8
  Top Layer w0.254: 40.57,18.03 40.57,13.64 38.61,11.68 38.61,11.12 RJ1.1
$5N392: length 11.6
  Top Layer w0.254: RJ1.2 36.63,11.94 38.35,11.94 40.21,13.8 40.21,15.54 39.57,16.19 39.57,18.03
$5N393: length 12
  Top Layer w0.18: 37.57,18.03 37.57,17.25 36.96,16.64 36.96,16.13 36.07,16.13 35.69,15.75 35.69,12.7 33.66,10.67 RJ1.3
$5N394: length 11.5
  Top Layer w0.18: v1(33.4,11.3) 34.92,12.83 34.92,15.75 35.56,16.38 35.7,16.38 36.57,17.25 36.57,18.03
  Bottom Layer w0.18: v1(33.4,11.3) 31.92,11.3 RJ1.6
$5N395: length 8.8
  Top Layer w0.254: 34.57,18.03 34.57,13.36 32.64,11.43 RJ1.4
$5N396: length 10.6
  Top Layer w0.18: 33.57,18.03 33.27,17.74 33.27,13.34 31.62,11.68 RJ1.5
$5N397: length 10.7
  Top Layer w0.18: RJ1.7 29.58,14.85 31.57,16.84 31.57,18.03
$5N398: length 8.9
  Top Layer w0.254: 30.57,18.03 30.57,17.36 29.21,16 29.21,10.64 RJ1.8
$5N662: length 13.3
  Top Layer w0.18: U8.23 24.82,16.82 22.86,14.86 22.86,13.95 18.3,9.4 17.89,9.4 RJ2.1
$5N663: length 12.8
  Top Layer w0.18: RJ2.2 15.86,10.16 18.42,10.16 22.58,14.32 22.58,15.34 23.75,16.51 23.75,17.84 U8.22
$5N664: length 14.8
  Top Layer w0.18: RJ2.3 14.66,10.74 15.34,11.43 19.05,11.43 21.82,14.2 U8.20
$5N665: length 15.1
  Top Layer w0.18: 14.9,11.81 18.8,11.81 21.23,14.25 21.23,16.72 20.82,17.13 U8.19
  Bottom Layer w0.18: RJ2.6 13.42,11.81 v1(14.73,11.81)
$5N666: length 10.7
  Top Layer w0.18: U8.17 18.82,16.41 18.54,16.13 17.4,16.13 13.64,12.37 RJ2.4
$5N667: length 11.9
  Top Layer w0.18: RJ2.5 12.62,11.92 17.82,17.13 U8.16
$5N668: length 11.9
  Top Layer w0.18: U8.14 15.82,15.85 10.58,10.61 RJ2.7
$5N669: length 10.1
  Top Layer w0.18: RJ2.8 14.82,15.25 U8.13
$5N1324: length 1.8
  Top Layer w0.254: R7.2 6.53,35.85 U7.2
$5N1325: length 5.1
  Top Layer w0.254: 3.17,40.56 4.01,40.56 4.57,40 6.6,40 6.6,41.29 U7.7
$5N1326: length 7.3
  Top Layer w0.254: U7.6 8,39.37 6.91,38.28 R9.1
$5N1328: length 1.7
  Top Layer w0.254: U9.2 7.95,36 U7.3
$5N3561: length 46.9
  Top Layer w0.254: C9.2 42.16,33.82 42.16,32.55 C29.2 C28.2 41.7,30.81 ; 41.57,31.95 U6.1 41.53,27.39 41.53,25.65 41.15,25.27 v1(40.05,25.27) 38.99,25.27 38.73,25.53 38.73,27.27 U6.4 ; U8.4 22.82,25.69 22.99,25.53 v1(24.24,25.53) 25.4,25.53 25.65,25.78 25.65,27.14 U8.1 25.82,29.38 26.92,30.48 C30.2 C31.2 27.01,33.92 27.05,33.96 29,33.96 C32.2
  Bottom Layer w0.254: v1(40.05,25.27) 39.8,25.53 v1(24.24,25.53)

## Copper pours and planes (outline as drawn; the poured copper is in the pictures)
GND on Top Layer: -5.08,102.36 67.56,102.36 67.56,-2.79 -5.08,-2.79
GND on Bottom Layer: -1.52,103.38 63.88,103.38 63.88,-10.03 -1.52,-10.03

Small or netless copper shapes (teardrops, artwork), in the pictures only: 435 on Top Layer, 127 on Bottom Layer

## Text on the board
Bottom Silkscreen Layer: BY 何亚红 | 核心板-001 V2024.04.22 | HLK-7688A核心板: / -可采用OpenWrt开发 / -USB Host X 1 / -WAN X 1 / -LAN X1 / -支持PoE供电(受电端) / -支持9V~48V供电(不区分正负)
Top Silkscreen Layer: SCS | GND | U1T | SMI | ICK | IO0 | SCK | SMO | U1R | IDA | 3V3 | SCL | SDI | WS | CLK | SDO | SDA | REFCLK | AUDIO | WAN | LAN/DEBUG
